# Altium project Switch_Matrix_32_2.PrjPCB (part 2 of 3)

## Sheet Switch_Matrix_32_2_Supply.SchDoc: Switch Matrix 32:2
size 420 x 297 mm; EDA_Number: ARTIQ; Projet: Zotino; Author: G.Kasprowicz; CompanyName: WUT ISE; DrawnBy: G.Kasprowicz; Organization: WUT ISE; Address1: PW ISE; Address2: Nowowiejska 15/19 00-665 Warsaw; Address3: gkasprow@gmail.com; DocumentNumber: 6; Revision: 2; SheetNumber: 6; SheetTotal: 6; ModifiedBy: -; CheckedDate: -; Title2: Power Supply; DivGrp: WUT ISE; Designer: G.Kasprowicz; ModifiedDate: -; ProjectName: Sensor Box
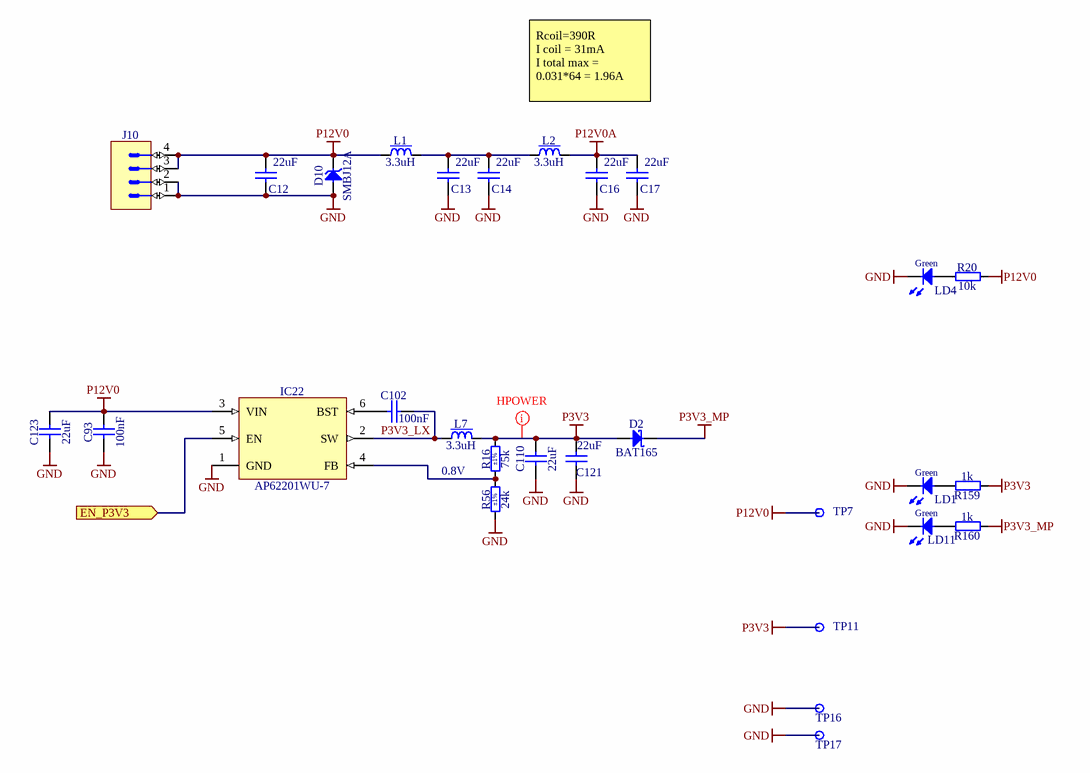
[diagram p2: Switch_Matrix_32_2_Supply.SchDoc]

### Parts
C12  22uF  [CAPC2012X135N]
C13  22uF  [CAPC2012X135N]
C14  22uF  [CAPC2012X135N]
C16  22uF  [CAPC2012X135N]
C17  22uF  [CAPC2012X135N]
C93  100nF  [CAPC1608X87N]
C102  100nF  [CAPC1608X87N]
C110  22uF  [CAPC2012X135N]
C121  22uF  [CAPC2012X135N]
C123  22uF  [CAPC2012X135N]
D2  BAT165  [SOD2512X110N]
D10  SMBJ12A  [DIOM5336X265N]
IC22  AP62201WU-7  [SOT95P280X100-6N]
J10  Mini-Fit Jr.™  [MOLEX_39-30-0040]  (value not drawn)
L1  3.3uH  [IND_WURTH_WE-TPC_4828]
L2  3.3uH  [IND_WURTH_WE-TPC_4828]
L7  3.3uH  [IND_WURTH_WE-TPC_4828]
LD1  Green  [LED_AVAGO_HSME-C110]
LD4  Green  [LED_KINGBRIGHT_KPH-1608CGCK]
LD11  Green  [LED_KINGBRIGHT_KPH-1608CGCK]
R16  75k  Tolerance: ±1%  [RESC1608X55N]
R20  10k  [RESC1608X55N]
R56  24k  Tolerance: ±1%  [RESC1608X55N]
R159  1k  [RESC1608X55N]
R160  1k  [RESC1608X55N]
TP7  Test Point  [TPS127]  (value not drawn)
TP11  Test Point  [TPS127]  (value not drawn)
TP16  Test Point  [TPS127]  (value not drawn)
TP17  Test Point  [TPS127]  (value not drawn)

### Ports
EN_P3V3 (in)

### Nets
GND: C12.1 C13.1 C14.1 C16.1 C17.1 C93.1 C110.1 C121.1 C123.1 D10.2(A) IC22.1(GND) J10.1 J10.2 LD1.1(C) LD4.1(C) LD11.1(C) R56.1 TP16.1 TP17.1
P3V3: C110.2 C121.2 D2.2(A) L7.2 R16.2 R159.1 TP11.1
P3V3_MP: D2.1(C) R160.1
P12V0: C12.2 C93.2 C123.2 D10.1(C) IC22.3(VIN) J10.3 J10.4 L1.1 R20.2 TP7.1
P12V0A: C16.2 C17.2 L2.2
P3V3_LX: C102.2 IC22.2(SW) L7.1
NetC13_2: C13.2 C14.2 L1.2 L2.1
NetC102_1: C102.1 IC22.6(BST)
NetIC22_4: IC22.4(FB) R16.1 R56.2
NetIC22_5: IC22.5(EN) ; port EN_P3V3
NetLD1_2: LD1.2(A) R159.2
NetLD4_2: LD4.2(A) R20.1
NetLD11_2: LD11.2(A) R160.2

### Layout directives
net class Hpower: P3V3

### Notes on the sheet
- Rcoil=390R
  I coil = 31mA
  I total max = 0.031*64 = 1.96A
- 0.8V
- Project/Equipment
- Document
- Designer
- Drawn by
- Check.by
- Copyright WUT ISE 2018.
  This documentation describes Open Hardware and is licensed under the CERN OHL v.1.1. You may redistribute and modify this documentation under the terms of the CERN OHL v.1.1. (http://ohwr.org/CERNOHL). This documentation is distributed WITHOUT ANY EXPRESS OR IMPLIED WARRANTY, INCLUDING OF MERCHANTABILITY, SATISFACTORY QUALITY AND FITNESS FOR A PARTICULAR PURPOSE. Please see the CERN OHL v.1.1 for applicable conditions.
- Contact
- File
- Last Mod.
- Print Date
- Sheet
- Size
- A3
- of
- Rev

### Library data of the parts
C12-C14 C16 C17 C110 C121 C123 = CC0805_22UF_16V_10%_X5R: Non-polarised capacitor; Part Description: SMD Multilayer Chip Ceramic Capacitor; Manufacturer: GENERIC; Manufacturer1 Part Number: C2012X5R1C226KT; Voltage: 16V; TC: X5R; Tolerance: ±10%; Part Number: CC0805_22UF_16V_10%_X5R; Component Kind: Standard; Component Type: Standard; Pin Count: 2; Value: 22uF; Status: Preferred; Manufacturer Part Number: CC0805_22UF_16V_10%_X5R; Case: 0805; Mounted: Yes; Socket: No; SMD: Yes; Sense: No; Manufacturer1 Example: TDK; Manufacturer1 ComponentHeight: 1.35mm; HelpURL: \\cern.ch\dfs\Applications\Altium\Datasheets\CC0805_X5R_TDK_C.pdf; Author: CERN DEM JLC; CreateDate: 25.10.2012; LatestRevisionDate: 25.10.2012
C93 C102 = CC0603_100NF_50V_10%_X7R: Non-polarised capacitor; Part Description: SMD Multilayer Chip Ceramic Capacitor; Manufacturer: GENERIC; Manufacturer1 Part Number: 223858615649; Voltage: 50V; TC: X7R; Tolerance: ±10%; Part Number: CC0603_100NF_50V_10%_X7R; Component Kind: Standard; Component Type: Standard; Pin Count: 2; Value: 100nF; Status: Preferred; Manufacturer Part Number: CC0603_100NF_50V_10%_X7R; Case: 0603; Mounted: Yes; Socket: No; SMD: Yes; Sense: No; Manufacturer1 Example: PHYCOMP; Manufacturer1 ComponentHeight: 0.87mm; HelpURL: \\cern.ch\dfs\Applications\Altium\Datasheets\CC0603_X7R_PHYCOMP.pdf; Author: CERN DEM JLC; CreateDate: 03.12.2007; LatestRevisionDate: 03.12.2007
D2 = BAT165: Schottky Diode; Part Description: Medium Power AF Schottky Diode; Manufacturer: INFINEON; Voltage: 40V; Power: 750mA; PressFit: No; Bonding: No; Part Number: BAT165; Component Kind: Standard; Component Type: Standard; Device: BAT165; PackageDescription: Small Outline Diode (SOD-323), 1.70mm W X 1.25mm L X 1.10mm H body,  IPC Medium Density; Manufacturer Part Number: BAT165; Pin Count: 2; Case: SOD-323; Mounted: Yes; Socket: No; SMD: Yes; Sense: No; ComponentHeight: 1.1mm; HelpURL: \\cern.ch\dfs\Applications\Altium\Datasheets\BAT165.pdf; Author: CERN DEM JLC; CreateDate: 12.11.2014; LatestRevisionDate: 12.11.2014
D10 = SMBJ12A: Zener Diode; Part Description: Uni-Directional Transient Voltage Suppressor Diode; Manufacturer: FAIRCHILD SEMICONDUCTOR; Voltage: 12V; Power: 600W; PressFit: No; Bonding: No; Part Number: SMBJ12A; Component Kind: Standard; Component Type: Standard; Device: SMBJ12A; PackageDescription: DO-214-AA/SMB Diode, Molded Body; 5.34mm L X 3.625mm W X 2.65mm H, IPC Medium Density; Manufacturer Part Number: SMBJ12A; Pin Count: 2; Case: DO-214AA; Mounted: Yes; Socket: No; SMD: Yes; Sense: No; ComponentHeight: 2.65mm; HelpURL: \\cern.ch\dfs\Applications\Altium\Datasheets\SMBJ.pdf; Author: CERN DEM JLC; CreateDate: 10.04.2013; LatestRevisionDate: 10.04.2013
IC22 = AP62201WU-7: 4.2V TO 18V INPUT, 2A LOW IQ SYNCHRONOUS BUCK CONVERTER; Manufacturer: DIODES INCORPORATED; PressFit: No; Bonding: No; Part Number: AP62201WU-7; Component Kind: Standard; Component Type: Standard; Device: AP62201WU-7; PackageDescription: SOT23, 0.95mm Pitch; 6 Pin, 1.625mm W X 2.90mm L X 1.00mm H body, IPC Medium Density; Part Description: 4.2V TO 18V INPUT, 2A LOW IQ SYNCHRONOUS BUCK CONVERTER; Manufacturer Part Number: AP62201WU-7; Pin Count: 6; Case: SOT23-6; Mounted: Yes; Socket: No; SMD: Yes; Sense: No; ComponentHeight: 1.1mm; HelpURL: \\cern.ch\dfs\Applications\Altium\Datasheets\AP6220x.pdf; Author: CERN DEM HF; CreateDate: 07.01.2022; LatestRevisionDate: 07.01.2022
J10 = MOLEX_39-30-0040: Connector 4 Male; Part Description: 4.20mm (.165") Pitch Mini-Fit Jr. Header, Dual Row, Right Angle with Snap-in Plastic Peg PCB Lock, 4 Circuits; Manufacturer: MOLEX; PressFit: No; Part Number: MOLEX_39-30-0040; Component Kind: Standard; Component Type: Standard; Pin Count: 4; Family: Mini-Fit Jr.™; Mounted: Yes; Socket: No; SMD: No; Sense: No; Status: None; Manufacturer Part Number: 39-30-0040; ComponentHeight: 11.4mm; HelpURL: \\cern.ch\dfs\Applications\Altium\Datasheets\MOLEX_39-30-0040.pdf; Author: CERN DEM JLC; CreateDate: 2018-10-02; LatestRevisionDate: 2018-10-02
L1 L2 L7 = IND_3.3UH_30%_WURTH_WE-TPC_744043003: Inductor With Core; Part Description: Shielded Tiny Power Inductor (WE-TPC Serie); Manufacturer: WURTH ELEKTRONIK; Power: 2.15A; Resistance: 0.03R; Tolerance: ±30%; Part Number: IND_3.3UH_30%_WURTH_WE-TPC_744043003; Component Kind: Standard; Component Type: Standard; Pin Count: 2; Value: 3.3uH; Manufacturer Part Number: 744043003; Mounted: Yes; Socket: No; SMD: Yes; Sense: No; ComponentHeight: 3mm; HelpURL: \\cern.ch\dfs\Applications\Altium\Datasheets\IND_WURTH_WE-TPC_744043003.pdf; Author: CERN DEM JLC; CreateDate: 12.07.2011; LatestRevisionDate: 24.01.2012
LD1 = LED_AVAGO_HSME-C110: LED Green 1C 2A; Part Description: High Performance Right Angle Chip Green LED; Manufacturer: AVAGO TECHNOLOGIES; PressFit: No; Bonding: No; Part Number: LED_AVAGO_HSME-C110; Component Kind: Standard; Component Type: Standard; Color: Green; PackageDescription: Green Chip LED, 2-Leads, Body 3.3x1.6mm, Side Emitting Package; Manufacturer Part Number: HSME-C110; Pin Count: 2; Case: 1206; Mounted: Yes; Socket: No; SMD: Yes; Sense: No; ComponentHeight: 1.1mm; HelpURL: \\cern.ch\dfs\Applications\Altium\Datasheets\LED_AVAGO_HSME-C110.pdf; ComponentLink1URL: \\cern.ch\dfs\Applications\Altium\Datasheets\LED_AVAGO_HSME-C110_DESIGN-GUIDE.pdf; ComponentLink1Description: Design Guide; Author: CERN DEM JMW; CreateDate: 30.07.2009; LatestRevisionDate: 20.06.2012
LD4 LD11 = LED_KINGBRIGHT_KPH-1608CGCK: LED Green 1C 2A; Part Description: SMD Green LED, Case 1.6mmX0.8mm(0603), 0.65mm Thickness; PressFit: No; Bonding: No; Part Number: LED_KINGBRIGHT_KPH-1608CGCK; Component Kind: Standard; Component Type: Standard; Color: Green; PackageDescription: SMT Green LED, Case 0603, Body L 1.6 x W 0.8mm H 0.65mm; Manufacturer: KINGBRIGHT; Manufacturer Part Number: KPH-1608CGCK; Pin Count: 2; Mounted: Yes; Socket: No; SMD: Yes; Sense: No; ComponentHeight: 0.65mm; HelpURL: \\cern.ch\dfs\Applications\Altium\Datasheets\LED_KINGBRIGHT_KPH-1608CGCK.pdf; Author: CERN DEM JLC; CreateDate: 03/07/2017; LatestRevisionDate: 03/07/2017
R16 = R0603_75K_1%_0.1W_100PPM: Resistor - 1%; Part Description: General Purpose Thick Film Chip Resistor; Manufacturer: GENERIC; Manufacturer1 Part Number: NRC06F7502TRF; Power: 0.1W; TC: ±100ppm/°C; PressFit: No; Part Number: R0603_75K_1%_0.1W_100PPM; Component Kind: Standard; Component Type: Standard; Pin Count: 2; Value: 75k; Status: Preferred; Manufacturer Part Number: R0603_75K_1%_0.1W_100PPM; Case: 0603; Mounted: Yes; Sense: No; Socket: No; SMD: Yes; Manufacturer1 Example: NIC COMPONENT; Manufacturer1 ComponentHeight: 0.55mm; HelpURL: \\cern.ch\dfs\Applications\Altium\Datasheets\R0603_NIC_NRC.pdf; Author: CERN DEM JLC; CreateDate: 03.12.2007; LatestRevisionDate: 13.03.2008
R20 = R0603_10K_1%_0.1W_100PPM: Resistor - 1%; Part Description: General Purpose Thick Film Chip Resistor; Manufacturer: GENERIC; Manufacturer1 Part Number: NRC06F1002TRF; Power: 0.1W; TC: ±100ppm/°C; PressFit: No; Part Number: R0603_10K_1%_0.1W_100PPM; Component Kind: Standard; Component Type: Standard; Pin Count: 2; Value: 10k; Status: Preferred; Tolerance: ±1%; Manufacturer Part Number: R0603_10K_1%_0.1W_100PPM; Case: 0603; Mounted: Yes; Sense: No; Socket: No; SMD: Yes; Manufacturer1 Example: NIC COMPONENT; Manufacturer1 ComponentHeight: 0.55mm; HelpURL: \\cern.ch\dfs\Applications\Altium\Datasheets\R0603_NIC_NRC.pdf; Author: CERN DEM JLC; CreateDate: 03.12.2007; LatestRevisionDate: 13.03.2008
R56 = R0603_24K_1%_0.1W_100PPM: Resistor - 1%; Part Description: General Purpose Thick Film Chip Resistor; Manufacturer: GENERIC; Manufacturer1 Part Number: NRC06F2402TRF; Power: 0.1W; TC: ±100ppm/°C; PressFit: No; Part Number: R0603_24K_1%_0.1W_100PPM; Component Kind: Standard; Component Type: Standard; Pin Count: 2; Value: 24k; Status: Preferred; Manufacturer Part Number: R0603_24K_1%_0.1W_100PPM; Case: 0603; Mounted: Yes; Sense: No; Socket: No; SMD: Yes; Manufacturer1 Example: NIC COMPONENT; Manufacturer1 ComponentHeight: 0.55mm; HelpURL: \\cern.ch\dfs\Applications\Altium\Datasheets\R0603_NIC_NRC.pdf; Author: CERN DEM JLC; CreateDate: 03.12.2007; LatestRevisionDate: 13.03.2008
R159 R160 = R0603_1K_1%_0.1W_100PPM: Resistor - 1%; Part Description: General Purpose Thick Film Chip Resistor; Manufacturer: GENERIC; Manufacturer1 Part Number: NRC06F1001TRF; Power: 0.1W; TC: ±100ppm/°C; PressFit: No; Part Number: R0603_1K_1%_0.1W_100PPM; Component Kind: Standard; Component Type: Standard; Pin Count: 2; Value: 1k; Status: Preferred; Tolerance: ±1%; Manufacturer Part Number: R0603_1K_1%_0.1W_100PPM; Case: 0603; Mounted: Yes; Sense: No; Socket: No; SMD: Yes; Manufacturer1 Example: NIC COMPONENT; Manufacturer1 ComponentHeight: 0.55mm; HelpURL: \\cern.ch\dfs\Applications\Altium\Datasheets\R0603_NIC_NRC.pdf; Author: CERN DEM JLC; CreateDate: 03.12.2007; LatestRevisionDate: 13.03.2008
TP7 TP11 TP16 TP17 = SMD_PAD_1.27X1.27MM: Part Description: 1.27mm x 1.27mm PCB Copper Area (SMD Test Point); Mounted: No; Part Number: SMD_PAD_1.27X1.27MM; Component Kind: Standard (No BOM); Component Type: Standard (No BOM); Pin Count: 1; Family: Test Point; Socket: No; SMD: Yes; Sense: No; Status: None; ComponentHeight: 0mm; HelpURL: Undefined; Author: CERN DEM JLC; CreateDate: 12.01.2008; LatestRevisionDate: 12.01.2008; PackageDescription: 1.27mm x 1.27mm PCB Copper Area (SMD Test Point)

## Sheet Relay_channel.SchDoc: Switch Matrix 32:2
size 420 x 297 mm; Author: G.Kasprowicz; CompanyName: WUT ISE; DrawnBy: G.Kasprowicz; Organization: WUT ISE; Address1: PW ISE; Address2: Nowowiejska 15/19 00-665 Warsaw; Address3: gkasprow@gmail.com; DocumentNumber: 2; Revision: 2; SheetNumber: 2; SheetTotal: 6; ModifiedBy: -; CheckedDate: -; Title2: Relay channel; DivGrp: WUT ISE; Designer: G.Kasprowicz; ModifiedDate: -; ProjectName: Sensor Box
Used 32 times, as channels Relay_channel1, Relay_channel2, Relay_channel3, Relay_channel4, Relay_channel5, Relay_channel6, Relay_channel7, Relay_channel8, Relay_channel9, Relay_channel10, Relay_channel11, Relay_channel12, Relay_channel13, Relay_channel14, Relay_channel15, Relay_channel16, Relay_channel17, Relay_channel18, Relay_channel19, Relay_channel20, Relay_channel21, Relay_channel22, Relay_channel23, Relay_channel24, Relay_channel25, Relay_channel26, Relay_channel27, Relay_channel28, Relay_channel29, Relay_channel30, Relay_channel31, Relay_channel32. Parts and nets are listed once, with the designators drawn on the sheet.
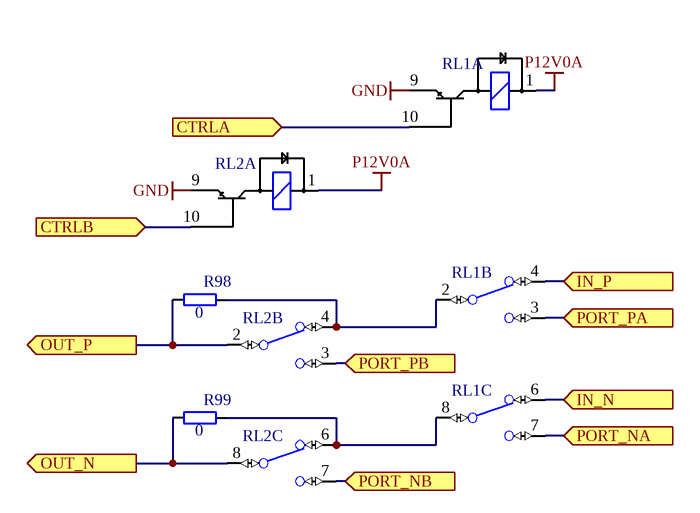
[diagram p3: Relay_channel.SchDoc]

### Parts
R98  0  [RESC1608X55N]
R99  0  [RESC1608X55N]
RL1  TELEDYNE_712TN  [REL_TELEDYNE_712TN]  (value not drawn)  (parts A,B,C of 3)
RL2  TELEDYNE_712TN  [REL_TELEDYNE_712TN]  (value not drawn)  (parts A,B,C of 3)

### Ports
CTRLA (in), CTRLB (in), IN_N (in), IN_P (in), OUT_N (out), OUT_P (out), PORT_NA (in), PORT_NB (in), PORT_PA (in), PORT_PB (in)

### Nets
GND: RL1.9 RL2.9
P12V0A: RL1.1 RL2.1
CTRLA: RL1.10 ; port CTRLA
CTRLB: RL2.10 ; port CTRLB
IN_N: RL1.6(NC) ; port IN_N
IN_P: RL1.4(NC) ; port IN_P
OUT_N: R99.1 RL2.8(C) ; port OUT_N
OUT_P: R98.1 RL2.2(C) ; port OUT_P
PORT_NA: RL1.7(NO) ; port PORT_NA
PORT_NB: RL2.7(NO) ; port PORT_NB
PORT_PA: RL1.3(NO) ; port PORT_PA
PORT_PB: RL2.3(NO) ; port PORT_PB
NetR98_2: R98.2 RL1.2(C) RL2.4(NC)
NetR99_2: R99.2 RL1.8(C) RL2.6(NC)

### Channels
Relay_channel1: designators end in A; ports CTRLA=CTRL1 CTRLB=CTRL1 IN_N=DAC_IN_N1 IN_P=DAC_IN_P1 OUT_N=DAC_OUT_N1 OUT_P=DAC_OUT_P1 PORT_NA=PORT_NA PORT_NB=PORT_NB PORT_PA=PORT_PA PORT_PB=PORT_PB
Relay_channel2: designators end in B; ports CTRLA=CTRL2 CTRLB=CTRL2 IN_N=DAC_IN_N2 IN_P=DAC_IN_P2 OUT_N=DAC_OUT_N2 OUT_P=DAC_OUT_P2 PORT_NA=PORT_NA PORT_NB=PORT_NB PORT_PA=PORT_PA PORT_PB=PORT_PB
Relay_channel3: designators end in C; ports CTRLA=CTRL3 CTRLB=CTRL3 IN_N=DAC_IN_N3 IN_P=DAC_IN_P3 OUT_N=DAC_OUT_N3 OUT_P=DAC_OUT_P3 PORT_NA=PORT_NA PORT_NB=PORT_NB PORT_PA=PORT_PA PORT_PB=PORT_PB
Relay_channel4: designators end in D; ports CTRLA=CTRL4 CTRLB=CTRL4 IN_N=DAC_IN_N4 IN_P=DAC_IN_P4 OUT_N=DAC_OUT_N4 OUT_P=DAC_OUT_P4 PORT_NA=PORT_NA PORT_NB=PORT_NB PORT_PA=PORT_PA PORT_PB=PORT_PB
Relay_channel5: designators end in E; ports CTRLA=CTRL5 CTRLB=CTRL5 IN_N=DAC_IN_N5 IN_P=DAC_IN_P5 OUT_N=DAC_OUT_N5 OUT_P=DAC_OUT_P5 PORT_NA=PORT_NA PORT_NB=PORT_NB PORT_PA=PORT_PA PORT_PB=PORT_PB
Relay_channel6: designators end in F; ports CTRLA=CTRL6 CTRLB=CTRL6 IN_N=DAC_IN_N6 IN_P=DAC_IN_P6 OUT_N=DAC_OUT_N6 OUT_P=DAC_OUT_P6 PORT_NA=PORT_NA PORT_NB=PORT_NB PORT_PA=PORT_PA PORT_PB=PORT_PB
Relay_channel7: designators end in G; ports CTRLA=CTRL7 CTRLB=CTRL7 IN_N=DAC_IN_N7 IN_P=DAC_IN_P7 OUT_N=DAC_OUT_N7 OUT_P=DAC_OUT_P7 PORT_NA=PORT_NA PORT_NB=PORT_NB PORT_PA=PORT_PA PORT_PB=PORT_PB
Relay_channel8: designators end in H; ports CTRLA=CTRL8 CTRLB=CTRL8 IN_N=DAC_IN_N8 IN_P=DAC_IN_P8 OUT_N=DAC_OUT_N8 OUT_P=DAC_OUT_P8 PORT_NA=PORT_NA PORT_NB=PORT_NB PORT_PA=PORT_PA PORT_PB=PORT_PB
Relay_channel9: designators end in I; ports CTRLA=CTRL9 CTRLB=CTRL9 IN_N=DAC_IN_N9 IN_P=DAC_IN_P9 OUT_N=DAC_OUT_N9 OUT_P=DAC_OUT_P9 PORT_NA=PORT_NA PORT_NB=PORT_NB PORT_PA=PORT_PA PORT_PB=PORT_PB
Relay_channel10: designators end in J; ports CTRLA=CTRL10 CTRLB=CTRL10 IN_N=DAC_IN_N10 IN_P=DAC_IN_P10 OUT_N=DAC_OUT_N10 OUT_P=DAC_OUT_P10 PORT_NA=PORT_NA PORT_NB=PORT_NB PORT_PA=PORT_PA PORT_PB=PORT_PB
Relay_channel11: designators end in K; ports CTRLA=CTRL11 CTRLB=CTRL11 IN_N=DAC_IN_N11 IN_P=DAC_IN_P11 OUT_N=DAC_OUT_N11 OUT_P=DAC_OUT_P11 PORT_NA=PORT_NA PORT_NB=PORT_NB PORT_PA=PORT_PA PORT_PB=PORT_PB
Relay_channel12: designators end in L; ports CTRLA=CTRL12 CTRLB=CTRL12 IN_N=DAC_IN_N12 IN_P=DAC_IN_P12 OUT_N=DAC_OUT_N12 OUT_P=DAC_OUT_P12 PORT_NA=PORT_NA PORT_NB=PORT_NB PORT_PA=PORT_PA PORT_PB=PORT_PB
Relay_channel13: designators end in M; ports CTRLA=CTRL13 CTRLB=CTRL13 IN_N=DAC_IN_N13 IN_P=DAC_IN_P13 OUT_N=DAC_OUT_N13 OUT_P=DAC_OUT_P13 PORT_NA=PORT_NA PORT_NB=PORT_NB PORT_PA=PORT_PA PORT_PB=PORT_PB
Relay_channel14: designators end in N; ports CTRLA=CTRL14 CTRLB=CTRL14 IN_N=DAC_IN_N14 IN_P=DAC_IN_P14 OUT_N=DAC_OUT_N14 OUT_P=DAC_OUT_P14 PORT_NA=PORT_NA PORT_NB=PORT_NB PORT_PA=PORT_PA PORT_PB=PORT_PB
Relay_channel15: designators end in O; ports CTRLA=CTRL15 CTRLB=CTRL15 IN_N=DAC_IN_N15 IN_P=DAC_IN_P15 OUT_N=DAC_OUT_N15 OUT_P=DAC_OUT_P15 PORT_NA=PORT_NA PORT_NB=PORT_NB PORT_PA=PORT_PA PORT_PB=PORT_PB
Relay_channel16: designators end in P; ports CTRLA=CTRL16 CTRLB=CTRL16 IN_N=DAC_IN_N16 IN_P=DAC_IN_P16 OUT_N=DAC_OUT_N16 OUT_P=DAC_OUT_P16 PORT_NA=PORT_NA PORT_NB=PORT_NB PORT_PA=PORT_PA PORT_PB=PORT_PB
Relay_channel17: designators end in Q; ports CTRLA=CTRL17 CTRLB=CTRL17 IN_N=DAC_IN_N17 IN_P=DAC_IN_P17 OUT_N=DAC_OUT_N17 OUT_P=DAC_OUT_P17 PORT_NA=PORT_NA PORT_NB=PORT_NB PORT_PA=PORT_PA PORT_PB=PORT_PB
Relay_channel18: designators end in R; ports CTRLA=CTRL18 CTRLB=CTRL18 IN_N=DAC_IN_N18 IN_P=DAC_IN_P18 OUT_N=DAC_OUT_N18 OUT_P=DAC_OUT_P18 PORT_NA=PORT_NA PORT_NB=PORT_NB PORT_PA=PORT_PA PORT_PB=PORT_PB
Relay_channel19: designators end in S; ports CTRLA=CTRL19 CTRLB=CTRL19 IN_N=DAC_IN_N19 IN_P=DAC_IN_P19 OUT_N=DAC_OUT_N19 OUT_P=DAC_OUT_P19 PORT_NA=PORT_NA PORT_NB=PORT_NB PORT_PA=PORT_PA PORT_PB=PORT_PB
Relay_channel20: designators end in T; ports CTRLA=CTRL20 CTRLB=CTRL20 IN_N=DAC_IN_N20 IN_P=DAC_IN_P20 OUT_N=DAC_OUT_N20 OUT_P=DAC_OUT_P20 PORT_NA=PORT_NA PORT_NB=PORT_NB PORT_PA=PORT_PA PORT_PB=PORT_PB
Relay_channel21: designators end in U; ports CTRLA=CTRL21 CTRLB=CTRL21 IN_N=DAC_IN_N21 IN_P=DAC_IN_P21 OUT_N=DAC_OUT_N21 OUT_P=DAC_OUT_P21 PORT_NA=PORT_NA PORT_NB=PORT_NB PORT_PA=PORT_PA PORT_PB=PORT_PB
Relay_channel22: designators end in V; ports CTRLA=CTRL22 CTRLB=CTRL22 IN_N=DAC_IN_N22 IN_P=DAC_IN_P22 OUT_N=DAC_OUT_N22 OUT_P=DAC_OUT_P22 PORT_NA=PORT_NA PORT_NB=PORT_NB PORT_PA=PORT_PA PORT_PB=PORT_PB
Relay_channel23: designators end in W; ports CTRLA=CTRL23 CTRLB=CTRL23 IN_N=DAC_IN_N23 IN_P=DAC_IN_P23 OUT_N=DAC_OUT_N23 OUT_P=DAC_OUT_P23 PORT_NA=PORT_NA PORT_NB=PORT_NB PORT_PA=PORT_PA PORT_PB=PORT_PB
Relay_channel24: designators end in X; ports CTRLA=CTRL24 CTRLB=CTRL24 IN_N=DAC_IN_N24 IN_P=DAC_IN_P24 OUT_N=DAC_OUT_N24 OUT_P=DAC_OUT_P24 PORT_NA=PORT_NA PORT_NB=PORT_NB PORT_PA=PORT_PA PORT_PB=PORT_PB
Relay_channel25: designators end in Y; ports CTRLA=CTRL25 CTRLB=CTRL25 IN_N=DAC_IN_N25 IN_P=DAC_IN_P25 OUT_N=DAC_OUT_N25 OUT_P=DAC_OUT_P25 PORT_NA=PORT_NA PORT_NB=PORT_NB PORT_PA=PORT_PA PORT_PB=PORT_PB
Relay_channel26: designators end in Z; ports CTRLA=CTRL26 CTRLB=CTRL26 IN_N=DAC_IN_N26 IN_P=DAC_IN_P26 OUT_N=DAC_OUT_N26 OUT_P=DAC_OUT_P26 PORT_NA=PORT_NA PORT_NB=PORT_NB PORT_PA=PORT_PA PORT_PB=PORT_PB
Relay_channel27: designators end in 27; ports CTRLA=CTRL27 CTRLB=CTRL27 IN_N=DAC_IN_N27 IN_P=DAC_IN_P27 OUT_N=DAC_OUT_N27 OUT_P=DAC_OUT_P27 PORT_NA=PORT_NA PORT_NB=PORT_NB PORT_PA=PORT_PA PORT_PB=PORT_PB
Relay_channel28: designators end in 28; ports CTRLA=CTRL28 CTRLB=CTRL28 IN_N=DAC_IN_N28 IN_P=DAC_IN_P28 OUT_N=DAC_OUT_N28 OUT_P=DAC_OUT_P28 PORT_NA=PORT_NA PORT_NB=PORT_NB PORT_PA=PORT_PA PORT_PB=PORT_PB
Relay_channel29: designators end in 29; ports CTRLA=CTRL29 CTRLB=CTRL29 IN_N=DAC_IN_N29 IN_P=DAC_IN_P29 OUT_N=DAC_OUT_N29 OUT_P=DAC_OUT_P29 PORT_NA=PORT_NA PORT_NB=PORT_NB PORT_PA=PORT_PA PORT_PB=PORT_PB
Relay_channel30: designators end in 30; ports CTRLA=CTRL30 CTRLB=CTRL30 IN_N=DAC_IN_N30 IN_P=DAC_IN_P30 OUT_N=DAC_OUT_N30 OUT_P=DAC_OUT_P30 PORT_NA=PORT_NA PORT_NB=PORT_NB PORT_PA=PORT_PA PORT_PB=PORT_PB
Relay_channel31: designators end in 31; ports CTRLA=CTRL31 CTRLB=CTRL31 IN_N=DAC_IN_N31 IN_P=DAC_IN_P31 OUT_N=DAC_OUT_N31 OUT_P=DAC_OUT_P31 PORT_NA=PORT_NA PORT_NB=PORT_NB PORT_PA=PORT_PA PORT_PB=PORT_PB
Relay_channel32: designators end in 32; ports CTRLA=CTRL32 CTRLB=CTRL32 IN_N=DAC_IN_N32 IN_P=DAC_IN_P32 OUT_N=DAC_OUT_N32 OUT_P=DAC_OUT_P32 PORT_NA=PORT_NA PORT_NB=PORT_NB PORT_PA=PORT_PA PORT_PB=PORT_PB

### Notes on the sheet
- Project/Equipment
- Document
- Designer
- Drawn by
- Check.by
- Copyright WUT ISE 2020.
  This documentation describes Open Hardware and is licensed under the CERN OHL v.1.2. You may redistribute and modify this documentation under the terms of the CERN OHL v.1.2. (http://ohwr.org/CERNOHL). This documentation is distributed WITHOUT ANY EXPRESS OR IMPLIED WARRANTY, INCLUDING OF MERCHANTABILITY, SATISFACTORY QUALITY AND FITNESS FOR A PARTICULAR PURPOSE. Please see the CERN OHL v.1.2 for applicable conditions.
- Contact
- File
- Last Mod.
- Print Date
- Sheet
- Size
- A3
- of
- Rev

### Library data of the parts
R98 R99 = R0603_0R_JUMPER: Resistor; Part Description: 1A (0.05R Max DC Resistance) Zero Ohm Jumper; Manufacturer: GENERIC; Manufacturer1 Part Number: NRC06Z0; PressFit: No; Part Number: R0603_0R_JUMPER; Component Kind: Standard; Component Type: Standard; Pin Count: 2; Value: 0; Status: Preferred; Manufacturer Part Number: R0603_0R_JUMPER; Case: 0603; Mounted: Yes; Sense: No; Socket: No; SMD: Yes; Manufacturer1 Example: NIC COMPONENT; Manufacturer1 ComponentHeight: 0.55mm; HelpURL: \\cern.ch\dfs\Applications\Altium\Datasheets\R0603_NIC_NRC.pdf; Author: CERN DEM JLC; CreateDate: 03.12.2007; LatestRevisionDate: 13.03.2008
RL1 RL2 = REL_TELEDYNE_712TN-12: DPDT Non-latching Commercial Sensitive Basic Relay; Part Number: REL_TELEDYNE__712TN-12; PressFit: No; Value: 12VDC; Component Kind: Standard; Component Type: Standard; Footprint: REL_TELEDYNE__712TN; Pin Count: 8; PackageDescription: TELEDYNE Case TO-5, 8 Leads, Body Diameter 9.4m, x Height 9.76mm, 732 Series; Mounted: Yes; Socket: No; SMD: No; Sense: No; Status: None; Part Description: DPDT Non-latching Commercial Sensitive Basic Relay; Manufacturer: TELEDYNE; Manufacturer Part Number: 712TN-12; ComponentHeight: 9.76mm; HelpURL: \\cern.ch\dfs\Applications\Altium\Datasheets\REL_TELEDYNE_732.pdf; Author: GK; CreateDate: 30.10.2013; LatestRevisionDate: 18.09.2014

## Sheet Switch_Matrix_CTRL.schdoc: Switch Matrix 32:2
size 420 x 297 mm; EDA_Number: ARTIQ; Projet: Switch_Matrix; Author: G.Kasprowicz; CompanyName: WUT ISE; DrawnBy: G.Kasprowicz; Organization: WUT ISE; Address1: PW ISE; Address2: Nowowiejska 15/19 00-665 Warsaw; Address3: gkasprow@gmail.com; DocumentNumber: 3; Revision: 2; SheetNumber: 3; SheetTotal: 6; ModifiedBy: -; CheckedDate: -; Title2: SPI extender; DivGrp: WUT ISE; Designer: G.Kasprowicz; ModifiedDate: -; ProjectName: Sensor Box
Used 2 times, as channels CTRLA, CTRLB. Parts and nets are listed once, with the designators drawn on the sheet.
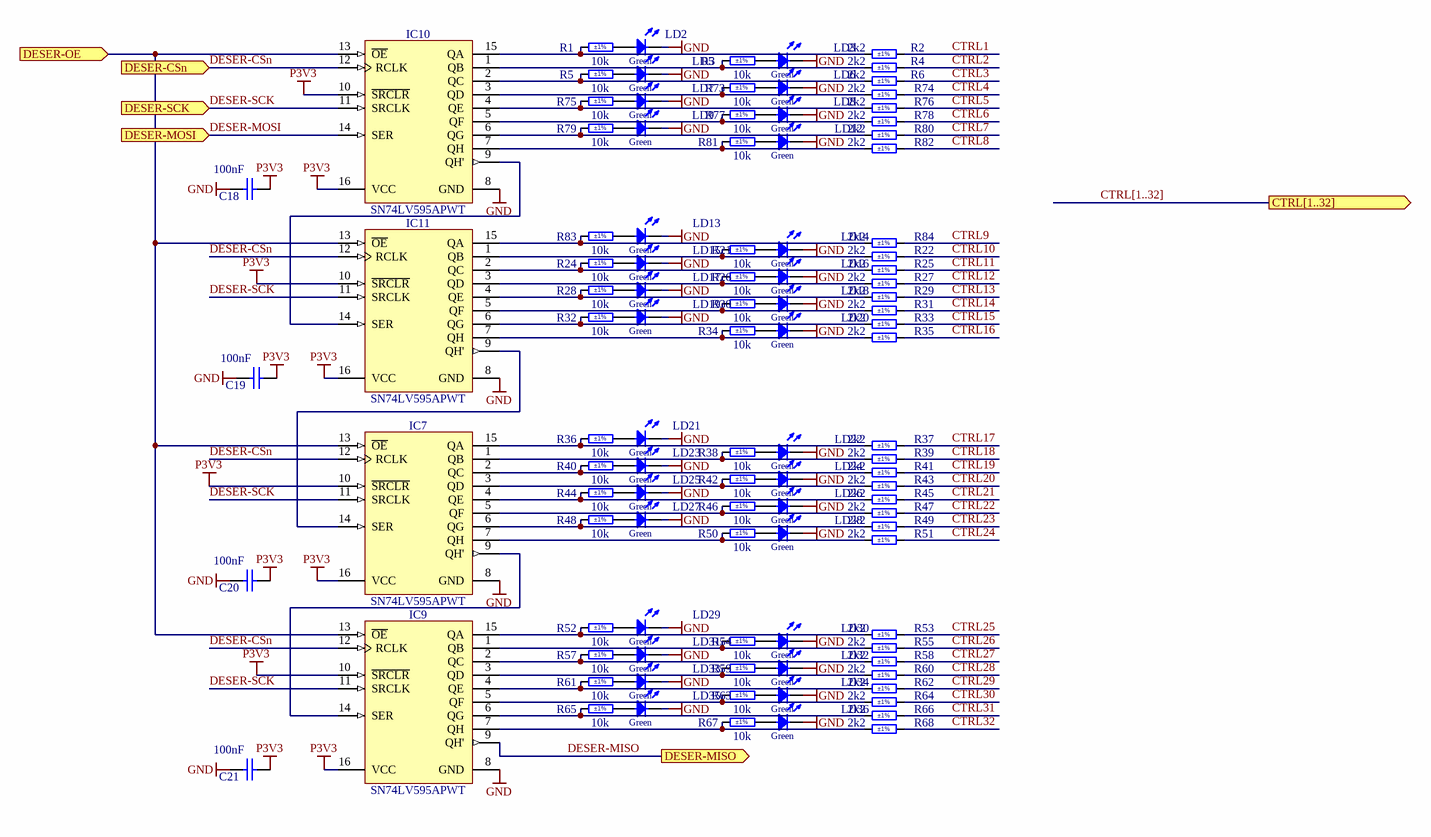
[diagram p4: Switch_Matrix_CTRL.schdoc]

### Parts
C18  100nF  [CAPC1608X87N]
C19  100nF  [CAPC1608X87N]
C20  100nF  [CAPC1608X87N]
C21  100nF  [CAPC1608X87N]
IC7  SN74LV595APWT  [SOP65P640X120-16N]
IC9  SN74LV595APWT  [SOP65P640X120-16N]
IC10  SN74LV595APWT  [SOP65P640X120-16N]
IC11  SN74LV595APWT  [SOP65P640X120-16N]
LD2  Green  [LED_KINGBRIGHT_KP-1608CGCK]
LD3  Green  [LED_KINGBRIGHT_KP-1608CGCK]
LD5  Green  [LED_KINGBRIGHT_KP-1608CGCK]
LD6  Green  [LED_KINGBRIGHT_KP-1608CGCK]
LD7  Green  [LED_KINGBRIGHT_KP-1608CGCK]
LD8  Green  [LED_KINGBRIGHT_KP-1608CGCK]
LD9  Green  [LED_KINGBRIGHT_KP-1608CGCK]
LD12  Green  [LED_KINGBRIGHT_KP-1608CGCK]
LD13  Green  [LED_KINGBRIGHT_KP-1608CGCK]
LD14  Green  [LED_KINGBRIGHT_KP-1608CGCK]
LD15  Green  [LED_KINGBRIGHT_KP-1608CGCK]
LD16  Green  [LED_KINGBRIGHT_KP-1608CGCK]
LD17  Green  [LED_KINGBRIGHT_KP-1608CGCK]
LD18  Green  [LED_KINGBRIGHT_KP-1608CGCK]
LD19  Green  [LED_KINGBRIGHT_KP-1608CGCK]
LD20  Green  [LED_KINGBRIGHT_KP-1608CGCK]
LD21  Green  [LED_KINGBRIGHT_KP-1608CGCK]
LD22  Green  [LED_KINGBRIGHT_KP-1608CGCK]
LD23  Green  [LED_KINGBRIGHT_KP-1608CGCK]
LD24  Green  [LED_KINGBRIGHT_KP-1608CGCK]
LD25  Green  [LED_KINGBRIGHT_KP-1608CGCK]
LD26  Green  [LED_KINGBRIGHT_KP-1608CGCK]
LD27  Green  [LED_KINGBRIGHT_KP-1608CGCK]
LD28  Green  [LED_KINGBRIGHT_KP-1608CGCK]
LD29  Green  [LED_KINGBRIGHT_KP-1608CGCK]
LD30  Green  [LED_KINGBRIGHT_KP-1608CGCK]
LD31  Green  [LED_KINGBRIGHT_KP-1608CGCK]
LD32  Green  [LED_KINGBRIGHT_KP-1608CGCK]
LD33  Green  [LED_KINGBRIGHT_KP-1608CGCK]
LD34  Green  [LED_KINGBRIGHT_KP-1608CGCK]
LD35  Green  [LED_KINGBRIGHT_KP-1608CGCK]
LD36  Green  [LED_KINGBRIGHT_KP-1608CGCK]
R1  10k  Tolerance: ±1%  [RESC1608X55N]
R2  2k2  Tolerance: ±1%  [RESC1608X55N]
R3  10k  Tolerance: ±1%  [RESC1608X55N]
R4  2k2  Tolerance: ±1%  [RESC1608X55N]
R5  10k  Tolerance: ±1%  [RESC1608X55N]
R6  2k2  Tolerance: ±1%  [RESC1608X55N]
R21  10k  Tolerance: ±1%  [RESC1608X55N]
R22  2k2  Tolerance: ±1%  [RESC1608X55N]
R24  10k  Tolerance: ±1%  [RESC1608X55N]
R25  2k2  Tolerance: ±1%  [RESC1608X55N]
R26  10k  Tolerance: ±1%  [RESC1608X55N]
R27  2k2  Tolerance: ±1%  [RESC1608X55N]
R28  10k  Tolerance: ±1%  [RESC1608X55N]
R29  2k2  Tolerance: ±1%  [RESC1608X55N]
R30  10k  Tolerance: ±1%  [RESC1608X55N]
R31  2k2  Tolerance: ±1%  [RESC1608X55N]
R32  10k  Tolerance: ±1%  [RESC1608X55N]
R33  2k2  Tolerance: ±1%  [RESC1608X55N]
R34  10k  Tolerance: ±1%  [RESC1608X55N]
R35  2k2  Tolerance: ±1%  [RESC1608X55N]
R36  10k  Tolerance: ±1%  [RESC1608X55N]
R37  2k2  Tolerance: ±1%  [RESC1608X55N]
R38  10k  Tolerance: ±1%  [RESC1608X55N]
R39  2k2  Tolerance: ±1%  [RESC1608X55N]
R40  10k  Tolerance: ±1%  [RESC1608X55N]
R41  2k2  Tolerance: ±1%  [RESC1608X55N]
R42  10k  Tolerance: ±1%  [RESC1608X55N]
R43  2k2  Tolerance: ±1%  [RESC1608X55N]
R44  10k  Tolerance: ±1%  [RESC1608X55N]
R45  2k2  Tolerance: ±1%  [RESC1608X55N]
R46  10k  Tolerance: ±1%  [RESC1608X55N]
R47  2k2  Tolerance: ±1%  [RESC1608X55N]
R48  10k  Tolerance: ±1%  [RESC1608X55N]
R49  2k2  Tolerance: ±1%  [RESC1608X55N]
R50  10k  Tolerance: ±1%  [RESC1608X55N]
R51  2k2  Tolerance: ±1%  [RESC1608X55N]
R52  10k  Tolerance: ±1%  [RESC1608X55N]
R53  2k2  Tolerance: ±1%  [RESC1608X55N]
R54  10k  Tolerance: ±1%  [RESC1608X55N]
R55  2k2  Tolerance: ±1%  [RESC1608X55N]
R57  10k  Tolerance: ±1%  [RESC1608X55N]
R58  2k2  Tolerance: ±1%  [RESC1608X55N]
R59  10k  Tolerance: ±1%  [RESC1608X55N]
R60  2k2  Tolerance: ±1%  [RESC1608X55N]
R61  10k  Tolerance: ±1%  [RESC1608X55N]
R62  2k2  Tolerance: ±1%  [RESC1608X55N]
R63  10k  Tolerance: ±1%  [RESC1608X55N]
R64  2k2  Tolerance: ±1%  [RESC1608X55N]
R65  10k  Tolerance: ±1%  [RESC1608X55N]
R66  2k2  Tolerance: ±1%  [RESC1608X55N]
R67  10k  Tolerance: ±1%  [RESC1608X55N]
R68  2k2  Tolerance: ±1%  [RESC1608X55N]
R73  10k  Tolerance: ±1%  [RESC1608X55N]
R74  2k2  Tolerance: ±1%  [RESC1608X55N]
R75  10k  Tolerance: ±1%  [RESC1608X55N]
R76  2k2  Tolerance: ±1%  [RESC1608X55N]
R77  10k  Tolerance: ±1%  [RESC1608X55N]
R78  2k2  Tolerance: ±1%  [RESC1608X55N]
R79  10k  Tolerance: ±1%  [RESC1608X55N]
R80  2k2  Tolerance: ±1%  [RESC1608X55N]
R81  10k  Tolerance: ±1%  [RESC1608X55N]
R82  2k2  Tolerance: ±1%  [RESC1608X55N]
R83  10k  Tolerance: ±1%  [RESC1608X55N]
R84  2k2  Tolerance: ±1%  [RESC1608X55N]

### Ports
CTRL[1..32] (out), DESER-CSn (in), DESER-MISO (out), DESER-MOSI (in), DESER-OE (in), DESER-SCK (in)

### Nets
GND: C18.1 C19.1 C20.1 C21.1 IC7.8(GND) IC9.8(GND) IC10.8(GND) IC11.8(GND) LD2.1(C) LD3.1(C) LD5.1(C) LD6.1(C) LD7.1(C) LD8.1(C) LD9.1(C) LD12.1(C) LD13.1(C) LD14.1(C) LD15.1(C) LD16.1(C) LD17.1(C) LD18.1(C) LD19.1(C) LD20.1(C) LD21.1(C) LD22.1(C) LD23.1(C) LD24.1(C) LD25.1(C) LD26.1(C) LD27.1(C) LD28.1(C) LD29.1(C) LD30.1(C) LD31.1(C) LD32.1(C) LD33.1(C) LD34.1(C) LD35.1(C) LD36.1(C)
P3V3: C18.2 C19.2 C20.2 C21.2 IC7.10(~{SRCLR}) IC7.16(VCC) IC9.10(~{SRCLR}) IC9.16(VCC) IC10.10(~{SRCLR}) IC10.16(VCC) IC11.10(~{SRCLR}) IC11.16(VCC)
CTRL1: R2.2
CTRL2: R4.2
CTRL3: R6.2
CTRL4: R74.2
CTRL5: R76.2
CTRL6: R78.2
CTRL7: R80.2
CTRL8: R82.2
CTRL9: R84.2
CTRL10: R22.2
CTRL11: R25.2
CTRL12: R27.2
CTRL13: R29.2
CTRL14: R31.2
CTRL15: R33.2
CTRL16: R35.2
CTRL17: R37.2
CTRL18: R39.2
CTRL19: R41.2
CTRL20: R43.2
CTRL21: R45.2
CTRL22: R47.2
CTRL23: R49.2
CTRL24: R51.2
CTRL25: R53.2
CTRL26: R55.2
CTRL27: R58.2
CTRL28: R60.2
CTRL29: R62.2
CTRL30: R64.2
CTRL31: R66.2
CTRL32: R68.2
DESER-CSn: IC7.12(RCLK) IC9.12(RCLK) IC10.12(RCLK) IC11.12(RCLK) ; port DESER-CSn
DESER-MISO: IC9.9(QH') ; port DESER-MISO
DESER-MOSI: IC10.14(SER) ; port DESER-MOSI
DESER-OE: IC7.13(~{OE}) IC9.13(~{OE}) IC10.13(~{OE}) IC11.13(~{OE}) ; port DESER-OE
DESER-SCK: IC7.11(SRCLK) IC9.11(SRCLK) IC10.11(SRCLK) IC11.11(SRCLK) ; port DESER-SCK
NetIC7_1: IC7.1(QB) R38.1 R39.1
NetIC7_2: IC7.2(QC) R40.1 R41.1
NetIC7_3: IC7.3(QD) R42.1 R43.1
NetIC7_4: IC7.4(QE) R44.1 R45.1
NetIC7_5: IC7.5(QF) R46.1 R47.1
NetIC7_6: IC7.6(QG) R48.1 R49.1
NetIC7_7: IC7.7(QH) R50.1 R51.1
NetIC7_9: IC7.9(QH') IC9.14(SER)
NetIC7_14: IC7.14(SER) IC11.9(QH')
NetIC7_15: IC7.15(QA) R36.1 R37.1
NetIC9_1: IC9.1(QB) R54.1 R55.1
NetIC9_2: IC9.2(QC) R57.1 R58.1
NetIC9_3: IC9.3(QD) R59.1 R60.1
NetIC9_4: IC9.4(QE) R61.1 R62.1
NetIC9_5: IC9.5(QF) R63.1 R64.1
NetIC9_6: IC9.6(QG) R65.1 R66.1
NetIC9_7: IC9.7(QH) R67.1 R68.1
NetIC9_15: IC9.15(QA) R52.1 R53.1
NetIC10_1: IC10.1(QB) R3.1 R4.1
NetIC10_2: IC10.2(QC) R5.1 R6.1
NetIC10_3: IC10.3(QD) R73.1 R74.1
NetIC10_4: IC10.4(QE) R75.1 R76.1
NetIC10_5: IC10.5(QF) R77.1 R78.1
NetIC10_6: IC10.6(QG) R79.1 R80.1
NetIC10_7: IC10.7(QH) R81.1 R82.1
NetIC10_9: IC10.9(QH') IC11.14(SER)
NetIC10_15: IC10.15(QA) R1.1 R2.1
NetIC11_1: IC11.1(QB) R21.1 R22.1
NetIC11_2: IC11.2(QC) R24.1 R25.1
NetIC11_3: IC11.3(QD) R26.1 R27.1
NetIC11_4: IC11.4(QE) R28.1 R29.1
NetIC11_5: IC11.5(QF) R30.1 R31.1
NetIC11_6: IC11.6(QG) R32.1 R33.1
NetIC11_7: IC11.7(QH) R34.1 R35.1
NetIC11_15: IC11.15(QA) R83.1 R84.1
NetLD2_2: LD2.2(A) R1.2
NetLD3_2: LD3.2(A) R3.2
NetLD5_2: LD5.2(A) R5.2
NetLD6_2: LD6.2(A) R73.2
NetLD7_2: LD7.2(A) R75.2
NetLD8_2: LD8.2(A) R77.2
NetLD9_2: LD9.2(A) R79.2
NetLD12_2: LD12.2(A) R81.2
NetLD13_2: LD13.2(A) R83.2
NetLD14_2: LD14.2(A) R21.2
NetLD15_2: LD15.2(A) R24.2
NetLD16_2: LD16.2(A) R26.2
NetLD17_2: LD17.2(A) R28.2
NetLD18_2: LD18.2(A) R30.2
NetLD19_2: LD19.2(A) R32.2
NetLD20_2: LD20.2(A) R34.2
NetLD21_2: LD21.2(A) R36.2
NetLD22_2: LD22.2(A) R38.2
NetLD23_2: LD23.2(A) R40.2
NetLD24_2: LD24.2(A) R42.2
NetLD25_2: LD25.2(A) R44.2
NetLD26_2: LD26.2(A) R46.2
NetLD27_2: LD27.2(A) R48.2
NetLD28_2: LD28.2(A) R50.2
NetLD29_2: LD29.2(A) R52.2
NetLD30_2: LD30.2(A) R54.2
NetLD31_2: LD31.2(A) R57.2
NetLD32_2: LD32.2(A) R59.2
NetLD33_2: LD33.2(A) R61.2
NetLD34_2: LD34.2(A) R63.2
NetLD35_2: LD35.2(A) R65.2
NetLD36_2: LD36.2(A) R67.2

### Channels
CTRLA: designators end in A; ports DESER-CSn=DESER-CSn DESER-MISO=DESER-MISO DESER-MOSI=DESER-MOSI DESER-OE=NetIC7A_13 DESER-SCK=DESER-SCK
CTRLB: designators end in B; ports DESER-CSn=DESER-CSn DESER-MISO=DESER-MISO DESER-MOSI=DESER-MOSI DESER-OE=NetIC7A_13 DESER-SCK=DESER-SCK

### Buses and harness runs
bus CTRL[1..32] = port CTRL[1..32]

### Notes on the sheet
- Project/Equipment
- Document
- Designer
- Drawn by
- Check.by
- Copyright WUT ISE 2018.
  This documentation describes Open Hardware and is licensed under the CERN OHL v.1.1. You may redistribute and modify this documentation under the terms of the CERN OHL v.1.1. (http://ohwr.org/CERNOHL). This documentation is distributed WITHOUT ANY EXPRESS OR IMPLIED WARRANTY, INCLUDING OF MERCHANTABILITY, SATISFACTORY QUALITY AND FITNESS FOR A PARTICULAR PURPOSE. Please see the CERN OHL v.1.1 for applicable conditions.
- Contact
- File
- Last Mod.
- Print Date
- Sheet
- Size
- A3
- of
- Rev

### Library data of the parts
C18-C21 = CC0603_100NF_50V_10%_X7R: as C93 on sheet Switch_Matrix_32_2_Supply; Part Number: CC0603_100NF_50V_10%_X7R; Component Kind: Standard; Component Type: Standard; Pin Count: 2; Value: 100nF; Status: Preferred; Manufacturer Part Number: CC0603_100NF_50V_10%_X7R; Case: 0603; Mounted: Yes; Socket: No; SMD: Yes; Sense: No; Manufacturer1 Example: PHYCOMP; Manufacturer1 ComponentHeight: 0.87mm; HelpURL: \\cern.ch\dfs\Applications\Altium\Datasheets\CC0603_X7R_PHYCOMP.pdf; Author: CERN DEM JLC; CreateDate: 03.12.2007; LatestRevisionDate: 03.12.2007
IC7 IC9-IC11 = SN74LV595APWT: 8-Bit Shift Register With 3-State Output Register; Manufacturer: TEXAS INSTRUMENTS; PressFit: No; Bonding: No; Part Number: SN74LV595APWT; Component Kind: Standard; Component Type: Standard; Device: SN74LV595APWT; PackageDescription: SOP, 0.65mm pitch; 16 pin, 4.40mm W X 5.00mm L X 1.20mm H body IPC Medium Density; Part Description: 8-Bit Shift Register With 3-State Output Register; Manufacturer Part Number: SN74LV595APWT; Pin Count: 16; Case: TSSOP16; Mounted: Yes; Socket: No; SMD: Yes; Sense: No; ComponentHeight: 1.2mm; Author: CERN DEM JLC; HelpURL: \\cern.ch\dfs\Applications\Altium\Datasheets\SN74LV595APWT.pdf; CreateDate: 10.05.2012; LatestRevisionDate: 10.05.2012
LD2 LD3 LD5-LD9 LD12-LD36 = LED_KINGBRIGHT_KP-1608CGCK: LED Green 1C 2A; Part Description: 1.6x0.8mm SMD Chip Green LED Lamp; PressFit: No; Bonding: No; Part Number: LED_KINGBRIGHT_KP-1608CGCK; Component Kind: Standard; Component Type: Standard; Color: Green; PackageDescription: SMT Green LED, Case 0603, Body L 1.60mm x W 0.80mm x H 1.10mm; Manufacturer: KINGBRIGHT; Manufacturer Part Number: KP-1608CGCK; Pin Count: 2; Case: 0603; Mounted: Yes; Socket: No; SMD: Yes; Sense: No; ComponentHeight: 1.1mm; HelpURL: \\cern.ch\dfs\Applications\Altium\Datasheets\LED_KINGBRIGHT_KP-1608CGCK.pdf; Author: CERN DEM HF; CreateDate: 01.10.2021; LatestRevisionDate: 01.10.2021
R1 R3 R5 R21 R24 R26 R28 R30 R32 R34 R36 R38 R40 R42 R44 R46 R48 R50 R52 R54 R57 R59 R61 R63 R65 R67 R73 R75 R77 R79 R81 R83 = R0603_10K_1%_0.1W_100PPM: as R20 on sheet Switch_Matrix_32_2_Supply; Part Number: R0603_10K_1%_0.1W_100PPM; Component Kind: Standard; Component Type: Standard; Pin Count: 2; Value: 10k; Status: Preferred; Manufacturer Part Number: R0603_10K_1%_0.1W_100PPM; Case: 0603; Mounted: Yes; Sense: No; Socket: No; SMD: Yes; Manufacturer1 Example: NIC COMPONENT; Manufacturer1 ComponentHeight: 0.55mm; HelpURL: \\cern.ch\dfs\Applications\Altium\Datasheets\R0603_NIC_NRC.pdf; Author: CERN DEM JLC; CreateDate: 03.12.2007; LatestRevisionDate: 13.03.2008
R2 R4 R6 R22 R25 R27 R29 R31 R33 R35 R37 R39 R41 R43 R45 R47 R49 R51 R53 R55 R58 R60 R62 R64 R66 R68 R74 R76 R78 R80 R82 R84 = R0603_2K2_1%_0.1W_100PPM: Resistor - 1%; Part Description: General Purpose Thick Film Chip Resistor; Manufacturer: GENERIC; Manufacturer1 Part Number: NRC06F2201TRF; Power: 0.1W; TC: ±100ppm/°C; PressFit: No; Part Number: R0603_2K2_1%_0.1W_100PPM; Component Kind: Standard; Component Type: Standard; Pin Count: 2; Value: 2k2; Status: Preferred; Manufacturer Part Number: R0603_2K2_1%_0.1W_100PPM; Case: 0603; Mounted: Yes; Sense: No; Socket: No; SMD: Yes; Manufacturer1 Example: NIC COMPONENT; Manufacturer1 ComponentHeight: 0.55mm; HelpURL: \\cern.ch\dfs\Applications\Altium\Datasheets\R0603_NIC_NRC.pdf; Author: CERN DEM JLC; CreateDate: 03.12.2007; LatestRevisionDate: 13.03.2008